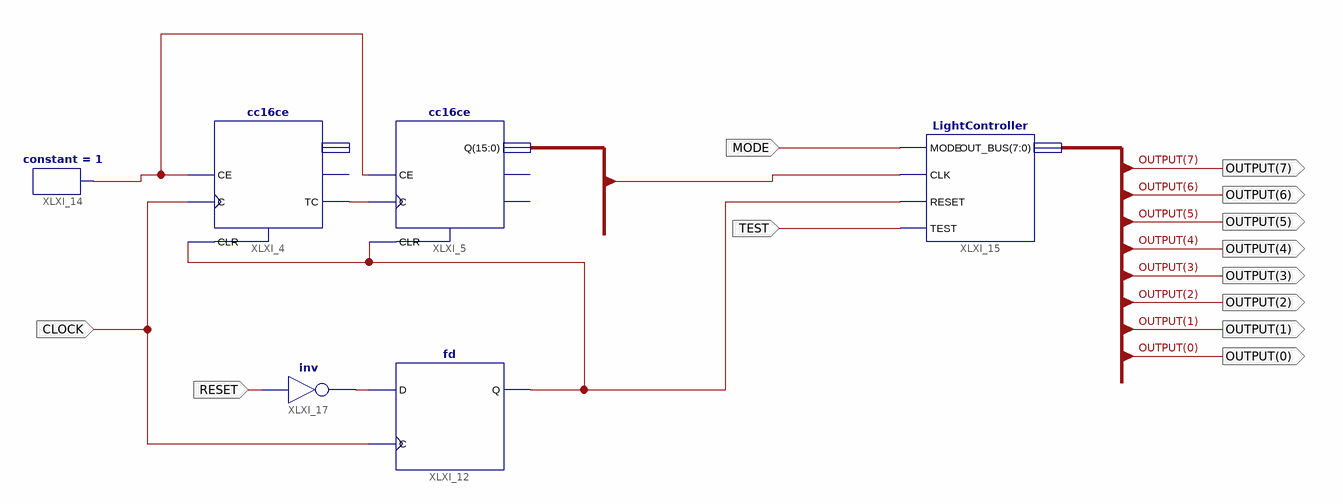
[diagram p0: schematic sheet 1]
// Xilinx ISE schematic TopLevel.sch (spartan3a) as structural Verilog: 6 symbols, 12 ports
module TopLevel (
  input  TEST,
  input  CLOCK,
  input  MODE,
  input  RESET,
  output [7:0] OUTPUT
);

  wire XLXN_30, XLXN_41, XLXN_42, XLXN_53;
  wire [15:0] CNT_BUS;

  cc16ce XLXI_4 (.C(CLOCK), .CE(XLXN_41), .CLR(XLXN_30), .TC(XLXN_42));  // open: CEO, Q
  cc16ce XLXI_5 (.C(XLXN_42), .CE(XLXN_41), .CLR(XLXN_30), .Q(CNT_BUS));  // open: CEO, TC
  fd XLXI_12 (.C(CLOCK), .D(XLXN_53), .Q(XLXN_30));
  constant #(.CValue("1")) XLXI_14 (.O(XLXN_41));
  LightController XLXI_15 (.MODE(MODE), .CLK(CNT_BUS[6]), .RESET(XLXN_30), .TEST(TEST), .OUT_BUS(OUTPUT));
  not XLXI_17 (XLXN_53, RESET);
endmodule
